# Altium schematic sheet Serial.SchDoc
size A; SheetNumber: 4; SheetTotal: 5
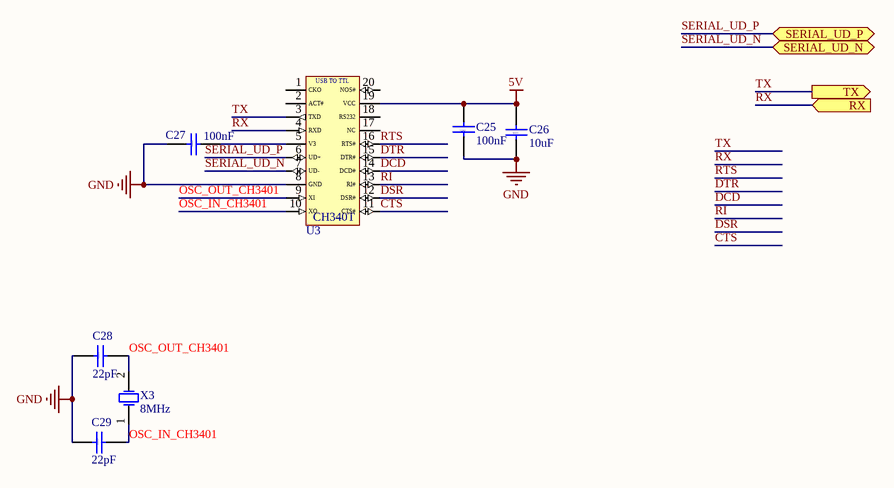
[diagram p0: Serial.SchDoc]

## Parts
C25  100nF  [RES 0805]
C26  10uF  [Res 1206]
C27  100nF  [RES 0805]
C28  22pF  [RES 0805]
C29  22pF  [RES 0805]
U3  CH340  [SSOP20]  (value not drawn)
X3  8MHz  [XTAL - SMD]

## Ports
RX (in), SERIAL_UD_N (bidir), SERIAL_UD_P (bidir), TX (out)

## Nets
5V: C25.2 C26.2 U3.19(VCC)
GND: C25.1 C26.1 C27.1 C28.1 C29.1 U3.8(GND)
CTS: U3.11(CTS#)
DCD: U3.14(DCD#)
DSR: U3.12(DSR#)
DTR: U3.15(DTR#)
OSC_IN_CH3401: C29.2 U3.10(XO) X3.1(OSC1)
OSC_OUT_CH3401: C28.2 U3.9(XI) X3.2(OSC2)
RI: U3.13(RI#)
RTS: U3.16(RTS#)
RX: U3.4(RXD) ; port RX
SERIAL_UD_N: U3.7(UD-) ; port SERIAL_UD_N
SERIAL_UD_P: U3.6(UD+) ; port SERIAL_UD_P
TX: U3.3(TXD) ; port TX
NetC27_2: C27.2 U3.5(V3)

Not connected (* = marked no-connect by the designer): U3 1(CKO) 2(ACT#) 17(NC) 18(RS232) 20(NOS#)

## Notes on the sheet
- (in symbol CAP 0805) 0805
- (in symbol CAP 1206) 1206
- (in symbol CH340T) USB TO TTL

## Library data of the parts
C25 C27-C29 = CAP 0805
C26 = CAP 1206
U3 = CH340T: USB to serial chip CH340
X3 = XTAL - SMD